# Altium schematic sheet qr reader.SchDoc
size 558 x 431 mm; SheetNumber: 1; SheetTotal: 1
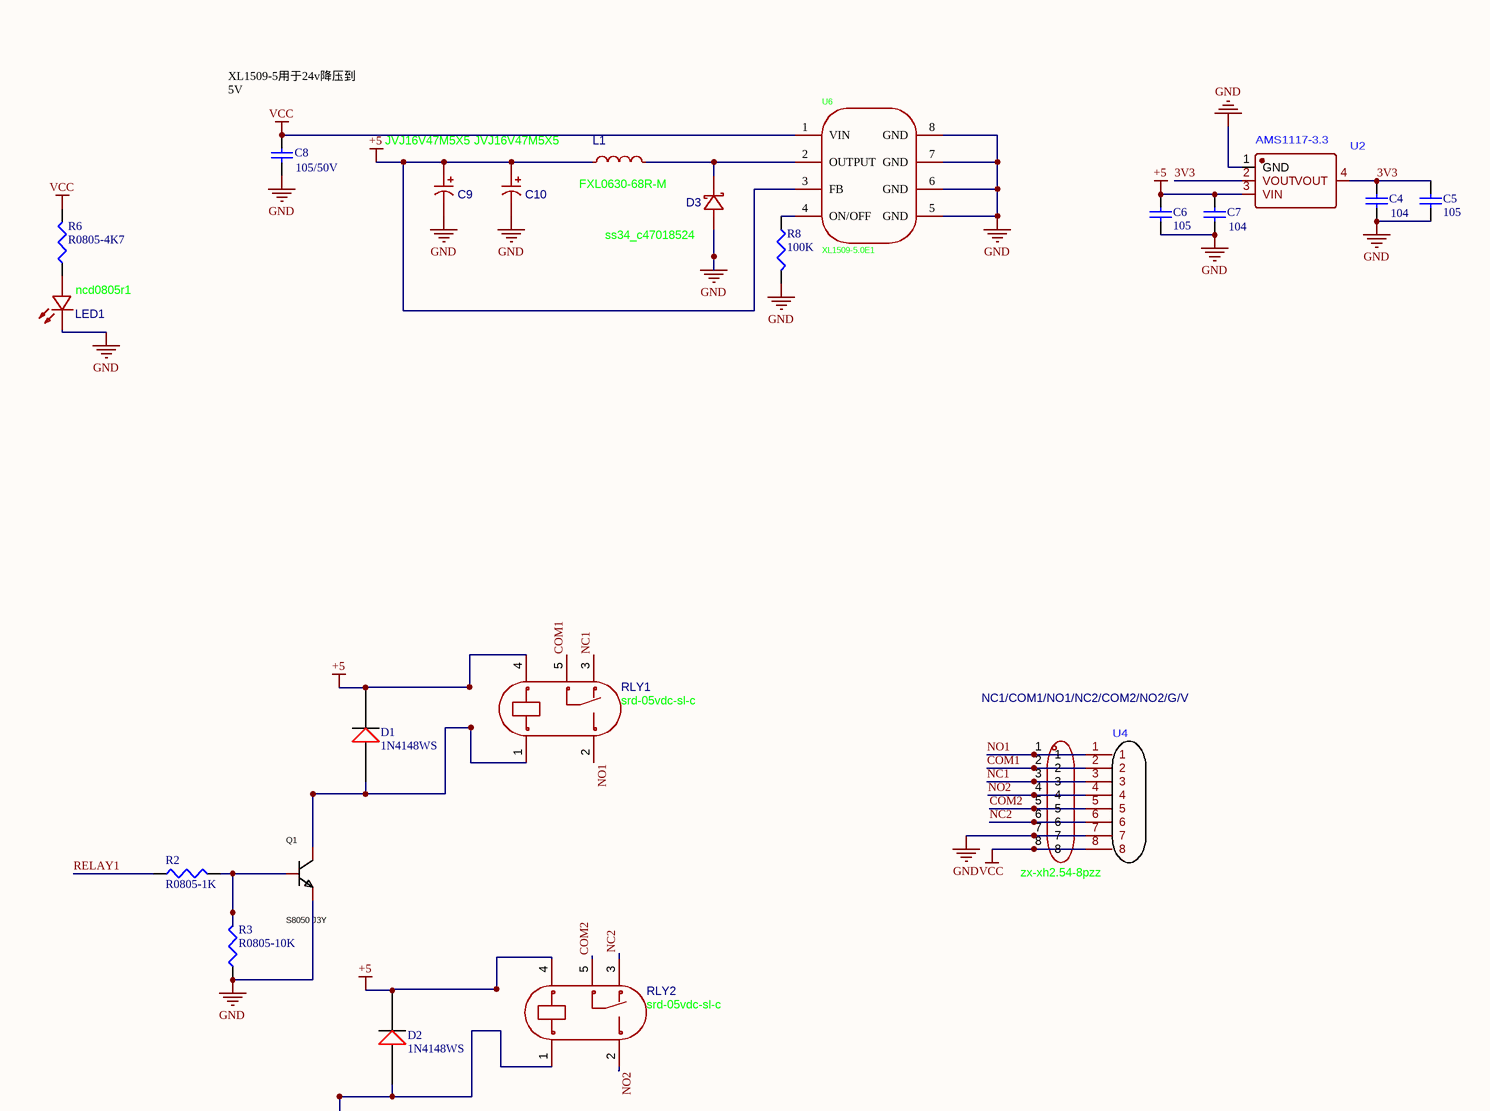
[diagram p0: qr reader.SchDoc, top left]
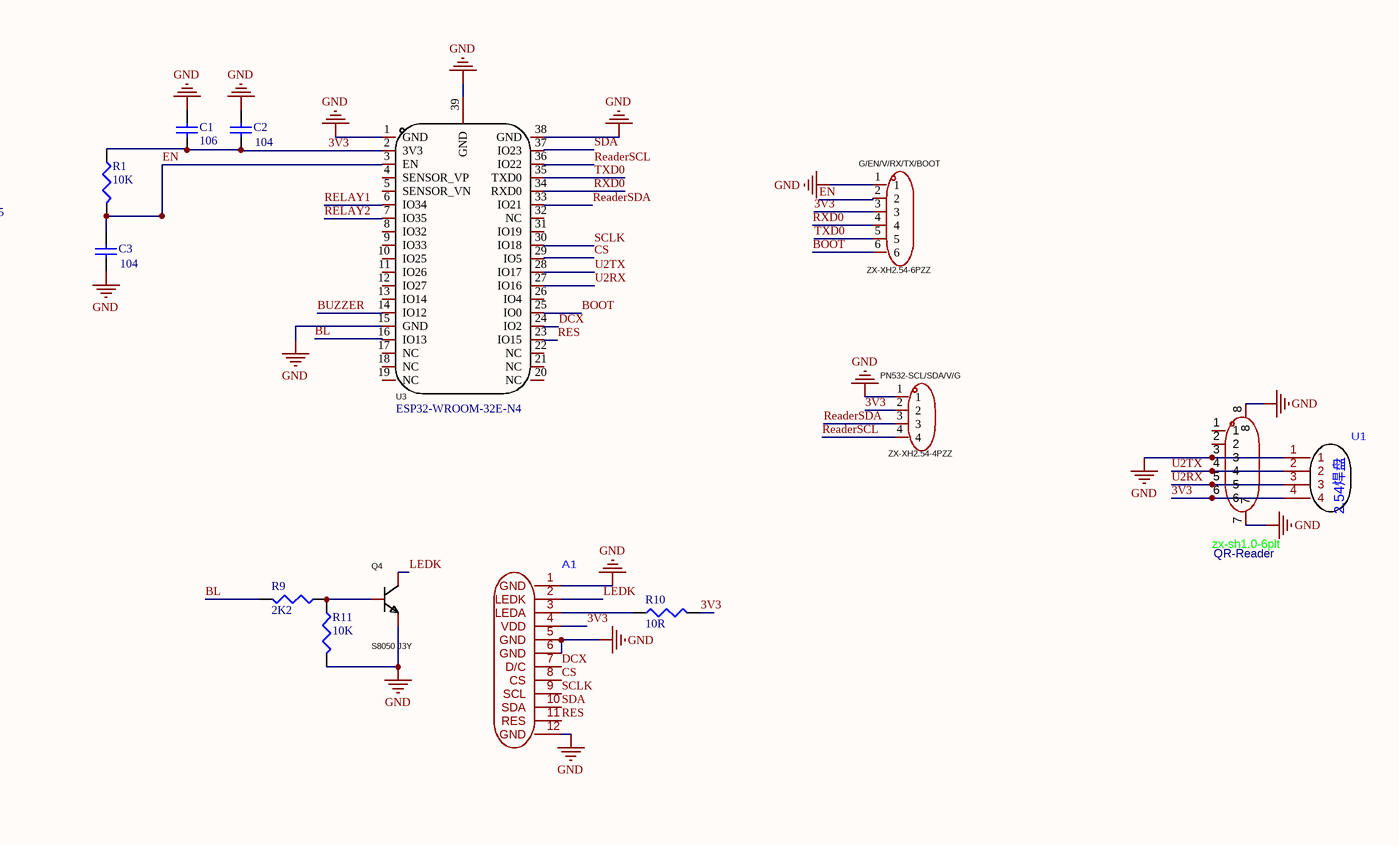
[diagram p1: qr reader.SchDoc, top right]
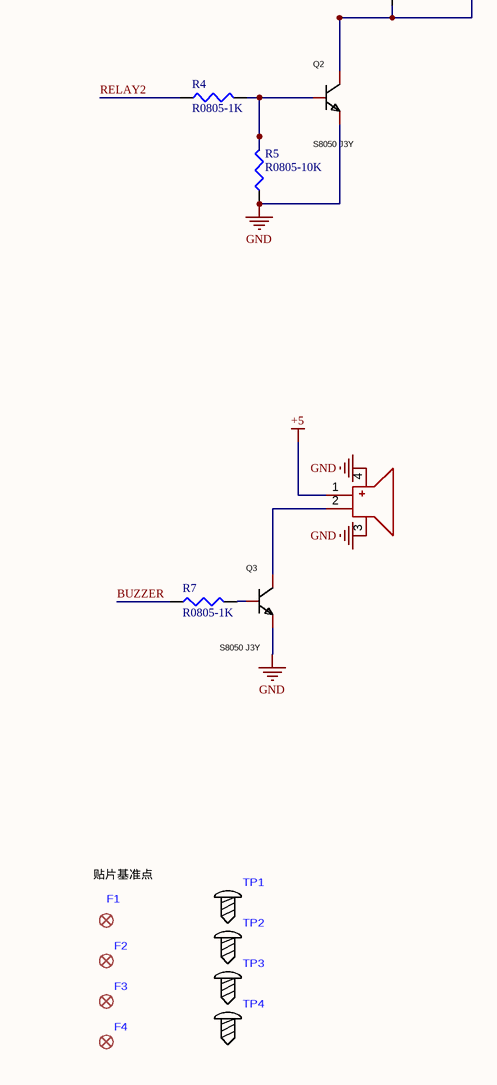
[diagram p2: qr reader.SchDoc, bottom left]

## Parts
A1  (no value)  [tft SCREEN]
BUZZER1  klj-8530-5027  [BUZ-SMD_4P-L8.5-W8.5-TL]  (value not drawn)
C1  value 106  [0805]  (hidden comment: Cap Semi)
C2  value 104  [0805]  (hidden comment: Cap Semi)
C3  value 104  [0805]  (hidden comment: Cap Semi)
C4  value 104  [0805]  (hidden comment: Cap Semi)
C5  value 105  [0805]  (hidden comment: Cap Semi)
C6  value 105  [0805]  (hidden comment: Cap Semi)
C7  value 104  [0805]  (hidden comment: Cap Semi)
C8  value 105/50V  [0805]  (hidden comment: 105)
C9  JVJ16V47M5X5  [CAP-SMD_BD5.0-L5.3-W5.3-LS6.5-FD-1]
C10  JVJ16V47M5X5  [CAP-SMD_BD5.0-L5.3-W5.3-LS6.5-FD-1]
D1  1N4148WS  [SOD323]
D2  1N4148WS  [SOD323]
D3  ss34_c47018524  [SMA_L4.3-W2.6-LS5.0-RD]
F1  (no value)  [FIDUCIAL-1.5X3]
F2  (no value)  [FIDUCIAL-1.5X3]
F3  (no value)  [FIDUCIAL-1.5X3]
F4  (no value)  [FIDUCIAL-1.5X3]
G/EN/V/RX/TX/BOOT  ZX-XH2.54-6PZZ  [CONN-TH_6P-P2.50_ZX-XH2.54-6PZZ]
L1  FXL0630-68R-M  [0630 - duplicate]
LED1  ncd0805r1  [LED0805-RD]
NC1/COM1/NO1/NC2/COM2/NO2/G/V  zx-xh2.54-8pzz  [CONN-TH_8P-P2.50-XH2.54-8P]
PN532-SCL/SDA/V/G  ZX-XH2.54-4PZZ  [CONN-TH_4P-P2.50_4PIN]
Q1  S8050 J3Y  [SOT-23-3_L3.0-W1.7-P0.95-LS2.9-BR]
Q2  S8050 J3Y  [SOT-23-3_L3.0-W1.7-P0.95-LS2.9-BR]
Q3  S8050 J3Y  [SOT-23-3_L3.0-W1.7-P0.95-LS2.9-BR]
Q4  S8050 J3Y  [SOT-23-3_L3.0-W1.7-P0.95-LS2.9-BR]
QR-Reader  zx-sh1.0-6plt  [CONN-SMD_6P-P1.00_ZX-SH1.0-6PLT]
R1  value 10K  [0805]  (hidden comment: Res3)
R2  R0805-1K  [0805]
R3  R0805-10K  [0805]
R4  R0805-1K  [0805]
R5  R0805-10K  [0805]
R6  R0805-4K7  [0805]
R7  R0805-1K  [0805]
R8  100K  [0805]
R9  value 2K2  [0805]  (hidden comment: Res3)
R10  value 10R  [0805]  (hidden comment: Res3)
R11  value 10K  [0805]  (hidden comment: Res3)
RLY1  srd-05vdc-sl-c  [RELAY-TH_SRD-XXVDC-XL-C]
RLY2  srd-05vdc-sl-c  [RELAY-TH_SRD-XXVDC-XL-C]
TP1  (no value)  [PCBComponent_1 - duplicate]
TP2  (no value)  [PCBComponent_1 - duplicate]
TP3  (no value)  [PCBComponent_1 - duplicate]
TP4  (no value)  [PCBComponent_1 - duplicate]
U1  (no value)  [2.54_PAD_4P]
U2  AMS1117-3.3  [SOT-223-3_L6.7-W3.7-P2.30-LS7.0-BR]
U3  ESP32-WROOM-32E-N4  [WIFI-SMD_ESP32-WROOM-32E]
U4  (no value)  [3.96_PAD_8P]
U6  XL1509-5.0E1  [SOIC-8_L5.0-W4.0-P1.27-LS6.0-BL]

## Nets
+5: BUZZER1.1(+) C6.1 C7.2 C9.1 C10.1 D1.2 D2.2 L1.1 RLY1.4 RLY2.4 U2.3(VIN) U6.3(FB)
GND: A1.1(GND) A1.5(GND) A1.6(GND) A1.12(GND) BUZZER1.3(NC) BUZZER1.4(NC) C1.1 C2.2 C3.1 C4.1 C5.2 C6.2 C7.1 C8.1 C9.2 C10.2 D3.2(A) G/EN/V/RX/TX/BOOT.1 LED1.1(-) NC1/COM1/NO1/NC2/COM2/NO2/G/V.7 PN532-SCL/SDA/V/G.1 Q1.2(E) Q2.2(E) Q3.2(E) Q4.2(E) QR-Reader.3 QR-Reader.7 QR-Reader.8 R3.1 R5.1 R8.2 R11.2 U1.1 U2.1(GND) U3.1(GND) U3.15(GND) U3.38(GND) U3.39(GND) U4.7 U6.5(GND) U6.6(GND) U6.7(GND) U6.8(GND)
VCC: C8.2 NC1/COM1/NO1/NC2/COM2/NO2/G/V.8 R6.2 U4.8 U6.1(VIN)
3V3: A1.4(VDD) C1.2 C2.1 C4.2 C5.1 G/EN/V/RX/TX/BOOT.3 PN532-SCL/SDA/V/G.2 QR-Reader.6 R1.1 R10.2 U1.4 U2.2(VOUT) U2.4(VOUT) U3.2(3V3)
BL: R9.2 U3.16(IO13)
BOOT: G/EN/V/RX/TX/BOOT.6 U3.25(IO0)
BUZZER: R7.1 U3.14(IO12)
COM1: NC1/COM1/NO1/NC2/COM2/NO2/G/V.2 RLY1.5 U4.2
COM2: NC1/COM1/NO1/NC2/COM2/NO2/G/V.5 RLY2.5 U4.5
CS: A1.8(CS) U3.29(IO5)
DCX: A1.7(D/C) U3.24(IO2)
EN: C3.2 G/EN/V/RX/TX/BOOT.2 R1.2 U3.3(EN)
LEDK: A1.2(LEDK) Q4.3(C)
NC1: NC1/COM1/NO1/NC2/COM2/NO2/G/V.3 RLY1.3 U4.3
NC2: NC1/COM1/NO1/NC2/COM2/NO2/G/V.6 RLY2.3 U4.6
NO1: NC1/COM1/NO1/NC2/COM2/NO2/G/V.1 RLY1.2 U4.1
NO2: NC1/COM1/NO1/NC2/COM2/NO2/G/V.4 RLY2.2 U4.4
ReaderSCL: PN532-SCL/SDA/V/G.4 U3.36(IO22)
ReaderSDA: PN532-SCL/SDA/V/G.3 U3.33(IO21)
RELAY1: R2.1 U3.6(IO34)
RELAY2: R4.1 U3.7(IO35)
RES: A1.11(RES) U3.23(IO15)
RXD0: G/EN/V/RX/TX/BOOT.4 U3.34(RXD0)
SCLK: A1.9(SCL) U3.30(IO18)
SDA: A1.10(SDA) U3.37(IO23)
TXD0: G/EN/V/RX/TX/BOOT.5 U3.35(TXD0)
U2RX: QR-Reader.5 U1.3 U3.27(IO16)
U2TX: QR-Reader.4 U1.2 U3.28(IO17)
NetA1_3: A1.3(LEDA) R10.1
NetBUZZER1_2: BUZZER1.2(-) Q3.3(C)
NetD1_1: D1.1 Q1.3(C) RLY1.1
NetD2_1: D2.1 Q2.3(C) RLY2.1
NetD3_1: D3.1(C) L1.2 U6.2(OUTPUT)
NetLED1_2: LED1.2(+) R6.1
NetQ1_1: Q1.1(B) R2.2 R3.2
NetQ2_1: Q2.1(B) R4.2 R5.2
NetQ3_1: Q3.1(B) R7.2
NetQ4_1: Q4.1(B) R9.1 R11.1
NetR8_1: R8.1 U6.4(ON/OFF)

Not connected (* = marked no-connect by the designer): QR-Reader 1 2; U3 4(SENSOR_VP) 5(SENSOR_VN) 8(IO32) 9(IO33) 10(IO25) 11(IO26) 12(IO27) 13(IO14) 17(NC) 18(NC) 19(NC) 20(NC) 21(NC) 22(NC) 26(IO4) 31(IO19) 32(NC)

## Notes on the sheet
- (near C8) XL1509-5用于24v降压到5V
- (near F1) 贴片基准点
- DWG. NO.
- REV.
- SHT.
- REVISION
- DESCRIPTION
- DATE
- APPROVED
- THIS DOCUMENT AND THE DATA DISCLOSED HEREIN OR HEREWITH IS THE PROPERTY OF ALTIUM LIMITED AND MAY BE FREELY DISTRIBUTED IN WHOLE. NO RIGHTS ARE RESERVED OR EXPRESS OR IMPLIED WARANTEE GIVEN.
- ENG:
- DSN:
- APPROVALS
- PROJECT
- DOCUMENT REVISION:
- DESIGN ITEM:
- CHK:
- BOM:
- REFERENCE DOCUMENTS
- PROJECT REVISION:
- TITLE
- FAB DWG:
- PCB DWG:
- ASSY DWG:
- SCALE:
- SIZE
- C
- CAGE CODE
- FILE NAME
- DWG NO.
- SHEET
- OF
- REV
- (in symbol 当面2.54焊盘) 2.54焊盘

## Library data of the parts
A1 = TFT1.54
BUZZER1 = klj-8530-5027: Manufacturer: KELIKING(凯丽金); AddInBom: yes; ModelId: 7c587082926741939d0805ac9c9a57ec; ModelName: BUZ-SMD_4P-L8.5-W8.5-H4.0; ModelTransform: 342.519,342.519,0,270,0,0,0.5,0.435,0; Symbol: KLJ-8530-5027; LCSC Part Name: 贴片蜂鸣器; SupplierPart: C556938; ManufacturerPart: KLJ-8530-5027; Supplier Footprint: SMD,8.5x8.5mm; JLCPCB Part Class: Extended Part; Datasheet: https://item.szlcsc.com/datasheet/KLJ-8530-5027/579412.html; Supplier: LCSC; ConvertToPcb: yes; FootprintName: BUZ-SMD_4P-L8.5-W8.5-TL
C1-C8 = Cap Semi: Capacitor (Semiconductor SIM Model); Published: 8-Jun-2000; LatestRevisionDate: 29-May-2009; LatestRevisionNote: IPC-7351 Footprint Added.; PackageReference: C1206; Publisher: Altium Limited; PackageDescription: Chip Capacitor
D3 = ss34_c47018524: 二极管配置:独立式;直流反向耐压(Vr):40V;整流电流:3A;; Manufacturer: baocheng(宝乘); ManufacturerPart: SS34; AddInBom: yes; ModelId: 8d2dd2e50a3a4b27821fa63d469a8f11; ModelTransform: 196.85,102.362,0,0,0,0,0,0,0; Diode Configuration: 独立式; Voltage - DC Reverse(Vr): 40V; Current - Rectified: 3A; Operating Junction Temperature Range: -55℃~+125℃; Non-Repetitive Peak Forward Surge Current: 80A; Symbol: SS34_C47018524; LCSC Part Name: 电压:40V 电流:3A; SupplierPart: C47018524; Supplier Footprint: SMA; JLCPCB Part Class: Extended Part; Datasheet: https://item.szlcsc.com/datasheet/SS34/49200019.html; Supplier: LCSC; ConvertToPcb: yes; FootprintName: SMA_L4.3-W2.6-LS5.0-RD; ModelName: SMA_L4.3-W2.6-LS5.0-RD
F1-F4 = FIDUCIAL1.5X3
G/EN/V/RX/TX/BOOT = ZX-XH2.54-6PZZ: Manufacturer: Megastar(兆星); Add into BOM: yes; Pins Structure: 1x6P; Pitch: 2.54mm; Reference Series: XH; Number of PINs Per Row: 6; Current Rating (Max): 3A; Symbol: ZX-XH2.54-6PZZ; Device: ZX-XH2.54-6PZZ; LCSC Part Name: ZX-XH2.54-6PZZ; Supplier Part: C7429636; Manufacturer Part: ZX-XH2.54-6PZZ; Supplier Footprint: 插件,P=2.54mm; JLCPCB Part Class: Extended Part; Datasheet: https://atta.szlcsc.com/upload/public/pdf/source/20230619/1243AD0A516E39CD3D274D8985780568.pdf; Supplier: LCSC; Convert to PCB: yes; Mounting Style: 直插; Number of Pins: 6P; Number of Rows: 1; Row Spacing: -; Contact Material: 黄铜; Contact Plating: 锡; Operating Temperature Range: -25℃~+85℃
L1 = FXL0630-8R2-M: Symbol: FXL0630-8R2-M
LED1 = ncd0805r1: 灯头类型:-;发光颜色:红色;正向压降(Vf):1.6V~2.6V;功率:65mW;正向电流:25mA;波长:615nm~630nm;二极管配置:独立二极管;透镜颜色:-;色温:-;发光强度:195mcd;发光角度:130°;载带方式:-;工作温度:-30℃~+85℃;; Manufacturer: 国星光电; Symbol: FC-2012HRK-620D; AddInBom: yes; ModelId: b1c5ed7a4f6e46d3bc6f6cc7c20f3fea; ModelTransform: 79.527,49.2125,0,0,0,0,0,0,0; Illumination Color: 红色; Power(Watts): 65mW; Forward Current: 25mA; Peak Wavelength: 630nm; Diode Configuration: 独立二极管; Luminous Intensity: 195mcd; Viewing Angle: 130°; LCSC Part Name: 片式发光二极管; SupplierPart: C84256; ManufacturerPart: NCD0805R1; Supplier Footprint: 0805; JLCPCB Part Class: Basic Part; Datasheet: https://item.szlcsc.com/datasheet/NCD0805R1/85425.html; Supplier: LCSC; ConvertToPcb: yes; FootprintName: LED0805-RD; ModelName: LED0805-RD; Lamp Holder Type: -; Voltage - Forward(Vf): 1.6V~2.6V; Wavelength - Dominant: 615nm~630nm; Lens Color: -; Color Temperature: -; Mounting Style: -; Operating Temperature: -30℃~+85℃
NC1/COM1/NO1/NC2/COM2/NO2/G/V = zx-xh2.54-8pzz: 插针结构:1x8P;间距:2.5mm;安装方式:直插;参考系列:XH;总PIN数:8P;排数:1;每排PIN数:8;行距:-;额定电流:3A;触头材质:黄铜;触头镀层:锡;工作温度:-25℃~+85℃;; Manufacturer: Megastar(兆星); AddInBom: yes; ModelId: 385b1d4b778b4141959d674ea048df76; ModelTransform: 885.825,228.346,0,180,0,0,0.591,-19.094,-137.795; Pins Structure: 1x8P; Pitch: 2.5mm; Reference Series: XH; Number of PINs Per Row: 8; Current Rating: 3A; Voltage Rating: 250V; Plastic Material: PA66; Flame Retardant Rating: UL94V-0; Z-Height of the Board: 7mm; X-Length of Bottom Edge on Board (Spacing Line): 22.5mm; Y-Width of Bottom Edge on Board: 5.9mm; Symbol: ZX-XH2.54-8PZZ; LCSC Part Name: 1x8P 间距:2.5mm 直插 系列:XH; SupplierPart: C7429638; ManufacturerPart: ZX-XH2.54-8PZZ; Supplier Footprint: 插件,P=2.5mm; JLCPCB Part Class: Extended Part; Datasheet: https://item.szlcsc.com/datasheet/ZX-XH2.54-8PZZ/8427555.html; Supplier: LCSC; ConvertToPcb: yes; FootprintName: CONN-TH_8P-P2.50-XH2.54-8P; ModelName: CONN-TH_8P-P2.50-XH2.54-8P; Mounting Type: 直插; Number of Pins: 8P; Number of Rows: 1; Row Spacing: -; Contact Material: 黄铜; Contact Plating: 锡; Operating Temperature: -25℃~+85℃; Supplementary Features: -; Color: 白色
PN532-SCL/SDA/V/G = ZX-XH2.54-4PZZ: Manufacturer: Megastar(兆星); Add into BOM: yes; Pins Structure: 1x4P; Pitch: 2.54mm; Reference Series: XH; Number of PINs Per Row: 4; Current Rating (Max): 3A; Symbol: ZX-XH2.54-4PZZ; Device: ZX-XH2.54-4PZZ; LCSC Part Name: ZX-XH2.54-4PZZ; Supplier Part: C7429634; Manufacturer Part: ZX-XH2.54-4PZZ; Supplier Footprint: 插件,P=2.5mm; JLCPCB Part Class: Extended Part; Datasheet: https://atta.szlcsc.com/upload/public/pdf/source/20230619/B529A2163E0159A644AB3383D208FB03.pdf; Supplier: LCSC; Convert to PCB: yes; Mounting Style: 直插; Number of Pins: 4P; Number of Rows: 1; Row Spacing: -; Contact Material: 黄铜; Contact Plating: 锡; Operating Temperature Range: -25℃~+85℃
Q1-Q4 = S8050 J3Y_C2146: Manufacturer: CJ(江苏长电/长晶); Symbol: S8050_C2146; Add into BOM: yes; Transistor Type: NPN; Collector Current (Ic): 500mA; Collector-Emitter Breakdown Voltage (Vceo): 25V; Power Dissipation (Pd): 300mW; DC Current Gain (hFE@Ic,Vce): 200@50mA,1V; Transition Frequency (fT): 150MHz; Collector Cut-Off Current (Icbo): 100nA; Collector-Emitter Saturation Voltage (VCE(sat)@Ic,Ib): 600mV@500mA,50mA; Name: S8050 J3Y; Device: S8050 J3Y_C2146; LCSC Part Name: S8050 J3Y(RANGE:200-350) H档(200-350); Supplier Part: C2146; Manufacturer Part: S8050 J3Y; Supplier Footprint: SOT-23; JLCPCB Part Class: Basic Part; Datasheet: https://atta.szlcsc.com/upload/public/pdf/source/20140809/1457707209234.pdf; Supplier: LCSC; Convert to PCB: yes; Operating Temperature: -
QR-Reader = zx-sh1.0-6plt: 插针结构:1x6P;间距:1mm;安装方式:立贴;参考系列:SH;总PIN数:6P;排数:1;每排PIN数:6;行距:-;额定电流:1A;触头材质:黄铜;触头镀层:锡;工作温度:-40℃~+85℃;; Manufacturer: Megastar(兆星); AddInBom: yes; ModelId: 10d6ea9a3ab947538cc5c23cc299ff3f; ModelTransform: 328.7395,147.638,0,0,0,0,0,-13.071,0; Pins Structure: 1x6P; Pitch: 1mm; Reference Series: SH; Number of PINs Per Row: 6; Current Rating: 1A; Voltage Rating: 50V; Plastic Material: LCP; Supplementary Features: 辅助焊脚; Z-Height of the Board: 4.4mm; X-Length of Bottom Edge on Board (Spacing Line): 8.35mm; Y-Width of Bottom Edge on Board: 3.05mm; Symbol: ZX-SH1.0-6PLT; LCSC Part Name: 1x6P 间距:1mm 立贴 系列:SH; SupplierPart: C7430455; ManufacturerPart: ZX-SH1.0-6PLT; Supplier Footprint: SMD,P=1mm; JLCPCB Part Class: Extended Part; Datasheet: https://item.szlcsc.com/datasheet/ZX-SH1.0-6PLT/8430324.html; Supplier: LCSC; ConvertToPcb: yes; FootprintName: CONN-SMD_6P-P1.00_ZX-SH1.0-6PLT; ModelName: CONN-SMD_6P-P1.00_ZX-SH1.0-6PLT; Mounting Type: 立贴; Number of Pins: 6P; Number of Rows: 1; Row Spacing: -; Contact Material: 黄铜; Contact Plating: 锡; Operating Temperature: -40℃~+85℃; Flame Retardant Rating: -; Color: 米色
R1 R8-R11 = Res3: Resistor; Published: 8-Jun-2000; LatestRevisionDate: 29-May-2009; LatestRevisionNote: IPC-7351 Footprint Added.; PackageReference: J1-0603; Publisher: Altium Limited; PackageDescription: Chip Resistor
  R8: Value: 100K
R2-R7 = Res3: Resistor; Value: 1K; Published: 8-Jun-2000; LatestRevisionDate: 29-May-2009; LatestRevisionNote: IPC-7351 Footprint Added.; PackageReference: J1-0603; Publisher: Altium Limited; PackageDescription: Chip Resistor
RLY1 RLY2 = srd-05vdc-sl-c: 线圈电压:5V;触点形式:一组转换:1C(单刀双掷-转换);触点容量(电阻负载):-;最大切换电压:250V@AC;最大切换电流:15A;; Manufacturer: 松乐; AddInBom: yes; ModelId: d0eda9b8bf8746d18ae810ab88dc78e7; ModelName: RELAY-TH_L19.2-W15.6-H15.8; ModelTransform: 755.904,622.4397,0,0,0,0,34.882,0,-118.11; Coil Voltage: 5V; Coil Rated Power: 360mW; Switching Current(Max): 15A; Coil Type: 无极性-单线圈; Coil Resistance: 70Ω; Contact Resistance: 100mΩ; Operate Time: 10ms; Symbol: SRD-05VDC-SL-C; LCSC Part Name: 蓝色 单组转换型继电器; SupplierPart: C35449; ManufacturerPart: SRD-05VDC-SL-C; Supplier Footprint: 插件,19.2x15.6mm; JLCPCB Part Class: Extended Part; Datasheet: https://item.szlcsc.com/datasheet/SRD-05VDC-SL-C/36422.html; Supplier: LCSC; ConvertToPcb: yes; FootprintName: RELAY-TH_SRD-XXVDC-XL-C; Contact Form: 一组转换:1C(单刀双掷-转换); Number of Pins: 5; Contact Rating: -; Switching Voltage(Max): 250V@AC; Release Time: 10ms; Length: 19.2mm; Width: 15.6mm
TP1-TP4 = M3铜柱
U1 = 当面2.54焊盘
U2 = AMS1117-3.3_C917183
U3 = ESP32-WROOM-32E-N4: Manufacturer: ESPRESSIF(乐鑫); Symbol: ESP32-WROOM-32E(4MB); Add into BOM: yes; Device: ESP32-WROOM-32E-N4; Supplier: LCSC; Supplier Part: C701341; Manufacturer Part: ESP32-WROOM-32E-N4; JLCPCB Part Class: Extended Part; LCSC Part Name: 通用型Wi-Fi+BT+BLE MCU模组; Supplier Footprint: SMD,18x25.5mm; Datasheet: https://atta.szlcsc.com/upload/public/pdf/source/20220601/0020821B65DE5740BBACA5FACC5CF3B6.pdf; Convert to PCB: yes
U4 = 8P焊盘底面层
U6 = XL1509-5.0E1: Manufacturer: XLSEMI(芯龙); Add into BOM: yes; Function: 降压型; Output Type: 固定; Input Voltage: 4.5V~40V; Output Voltage: 5V; Output Current: 2A; Switching Frequency: 150kHz; Synchronous Rectification: 否; Number of Outputs: 1; Topology: 降压式; Quiescent Current (Iq): 150uA; Switch tube (built-in/external): 内置; Symbol: XL1509-5.0E1; Device: XL1509-5.0E1; LCSC Part Name: 2A 150KHz 40V 降压 DC-DC 转换器; Supplier Part: C61063; Manufacturer Part: XL1509-5.0E1; Supplier Footprint: SOIC-8; JLCPCB Part Class: Basic Part; Datasheet: https://atta.szlcsc.com/upload/public/pdf/source/20151126/1457707596805.pdf; Supplier: LCSC; Convert to PCB: yes; Operating Temperature: -40℃~+85℃
C9 C10 = JVJ16V47M5X5: Symbol: JVJ16V47M5X5